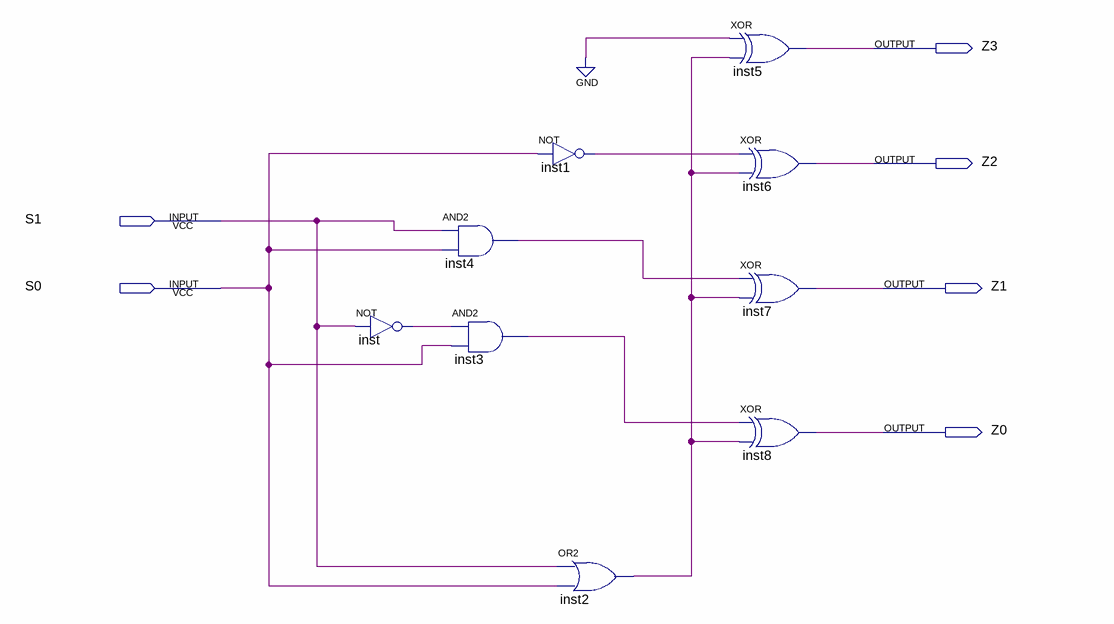
[diagram p0: schematic sheet]
// Quartus schematic BLOQUEZ.bdf as structural Verilog: 9 symbols, 6 pins
module BLOQUEZ (
  input  S1,
  input  S0,
  output Z3,
  output Z2,
  output Z1,
  output Z0
);

  wire inst1_out, inst2_out, inst3_out, inst4_out, inst_out;

  not inst (inst_out, S1);
  and inst4 (inst4_out, S1, S0);
  and inst3 (inst3_out, inst_out, S0);
  not inst1 (inst1_out, S0);
  or inst2 (inst2_out, S1, S0);
  xor inst5 (Z3, 1'b0, inst2_out);
  xor inst6 (Z2, inst1_out, inst2_out);
  xor inst7 (Z1, inst4_out, inst2_out);
  xor inst8 (Z0, inst3_out, inst2_out);
endmodule
